# EAGLE design PinguinoHDK (EAGLE 6.2)
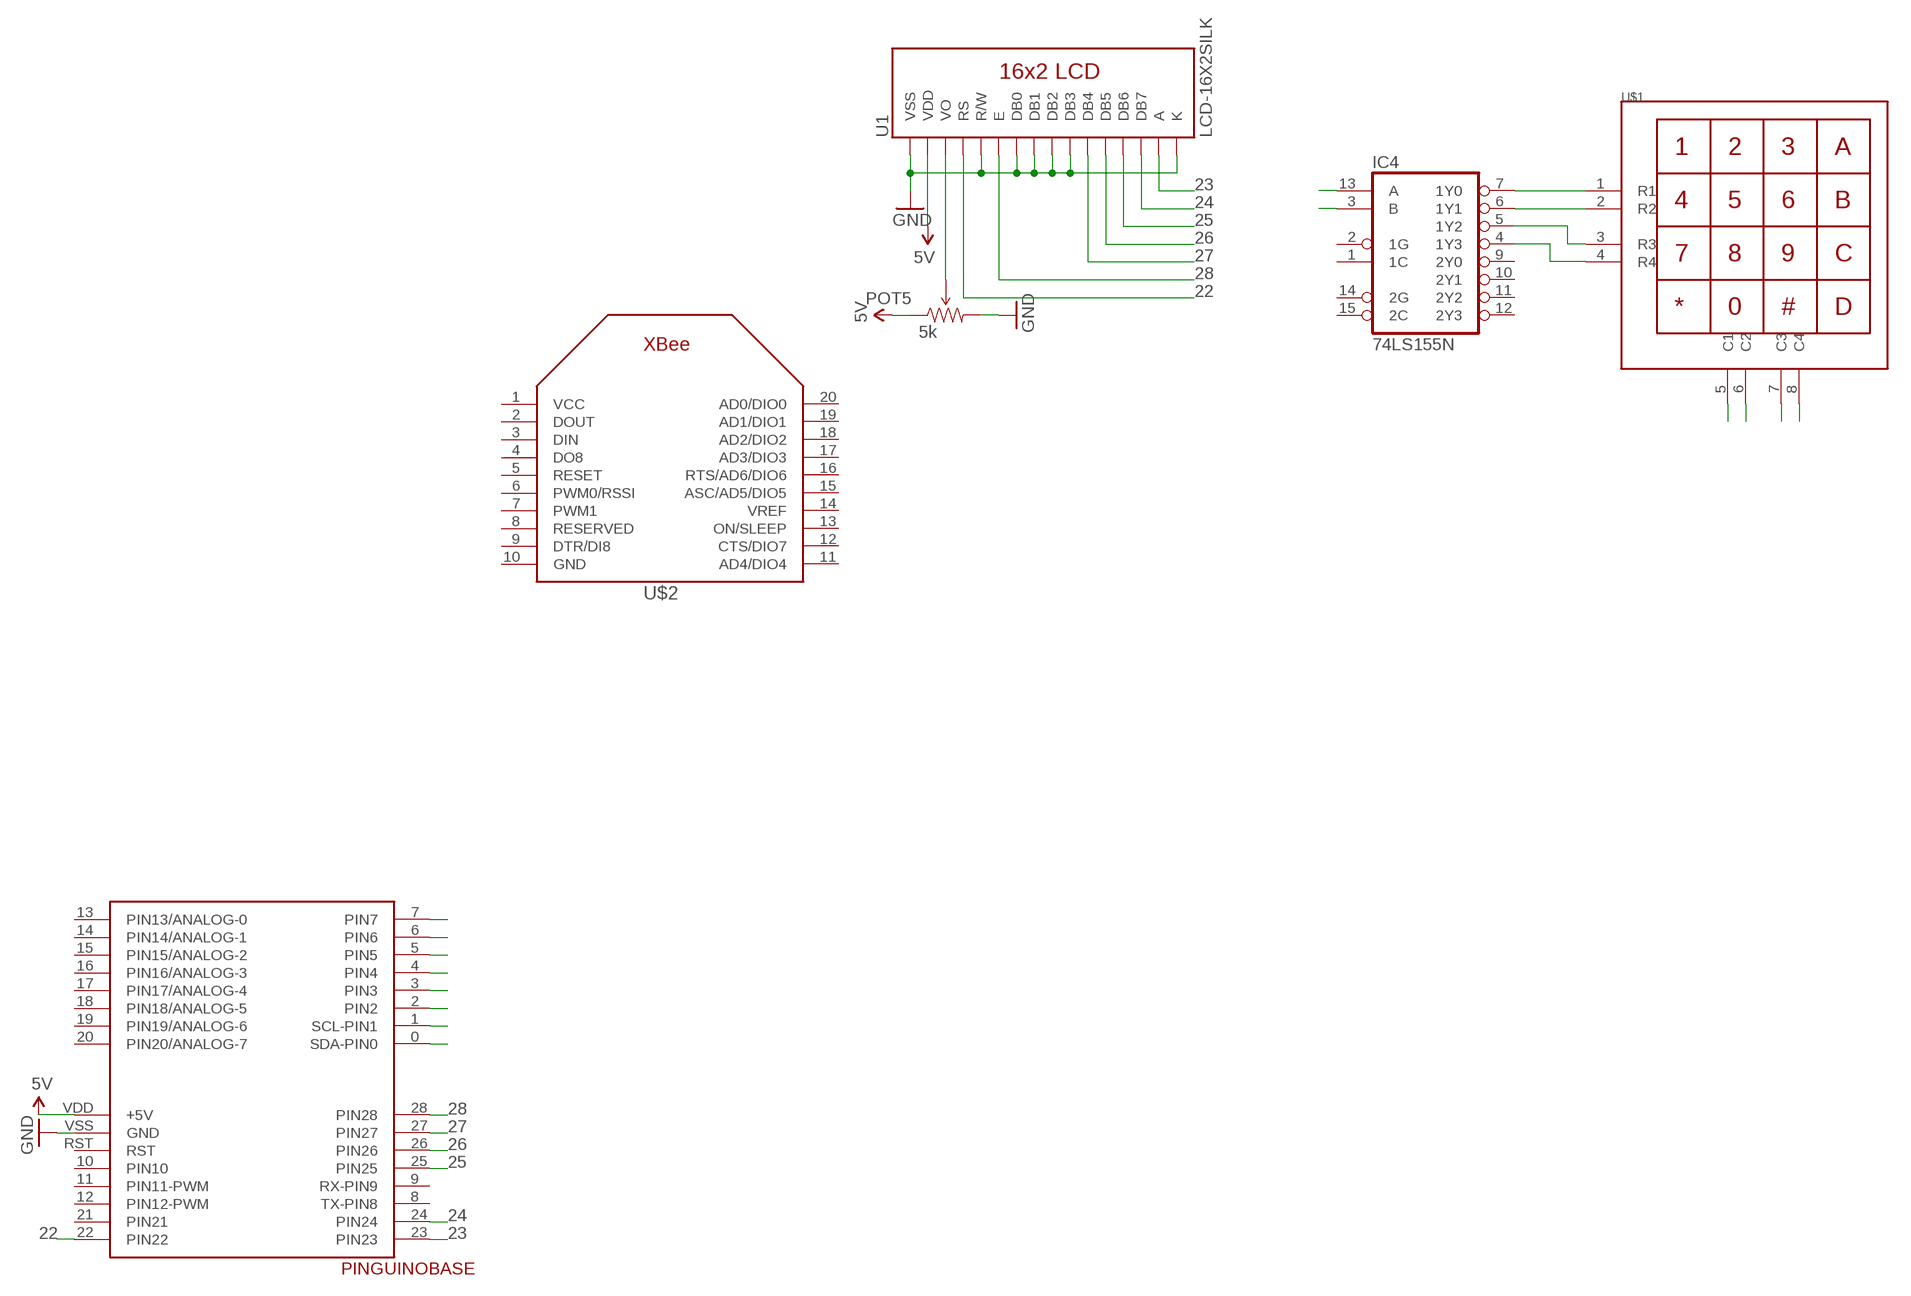
[diagram p0: schematic, sheet 1, part 1 of 2]
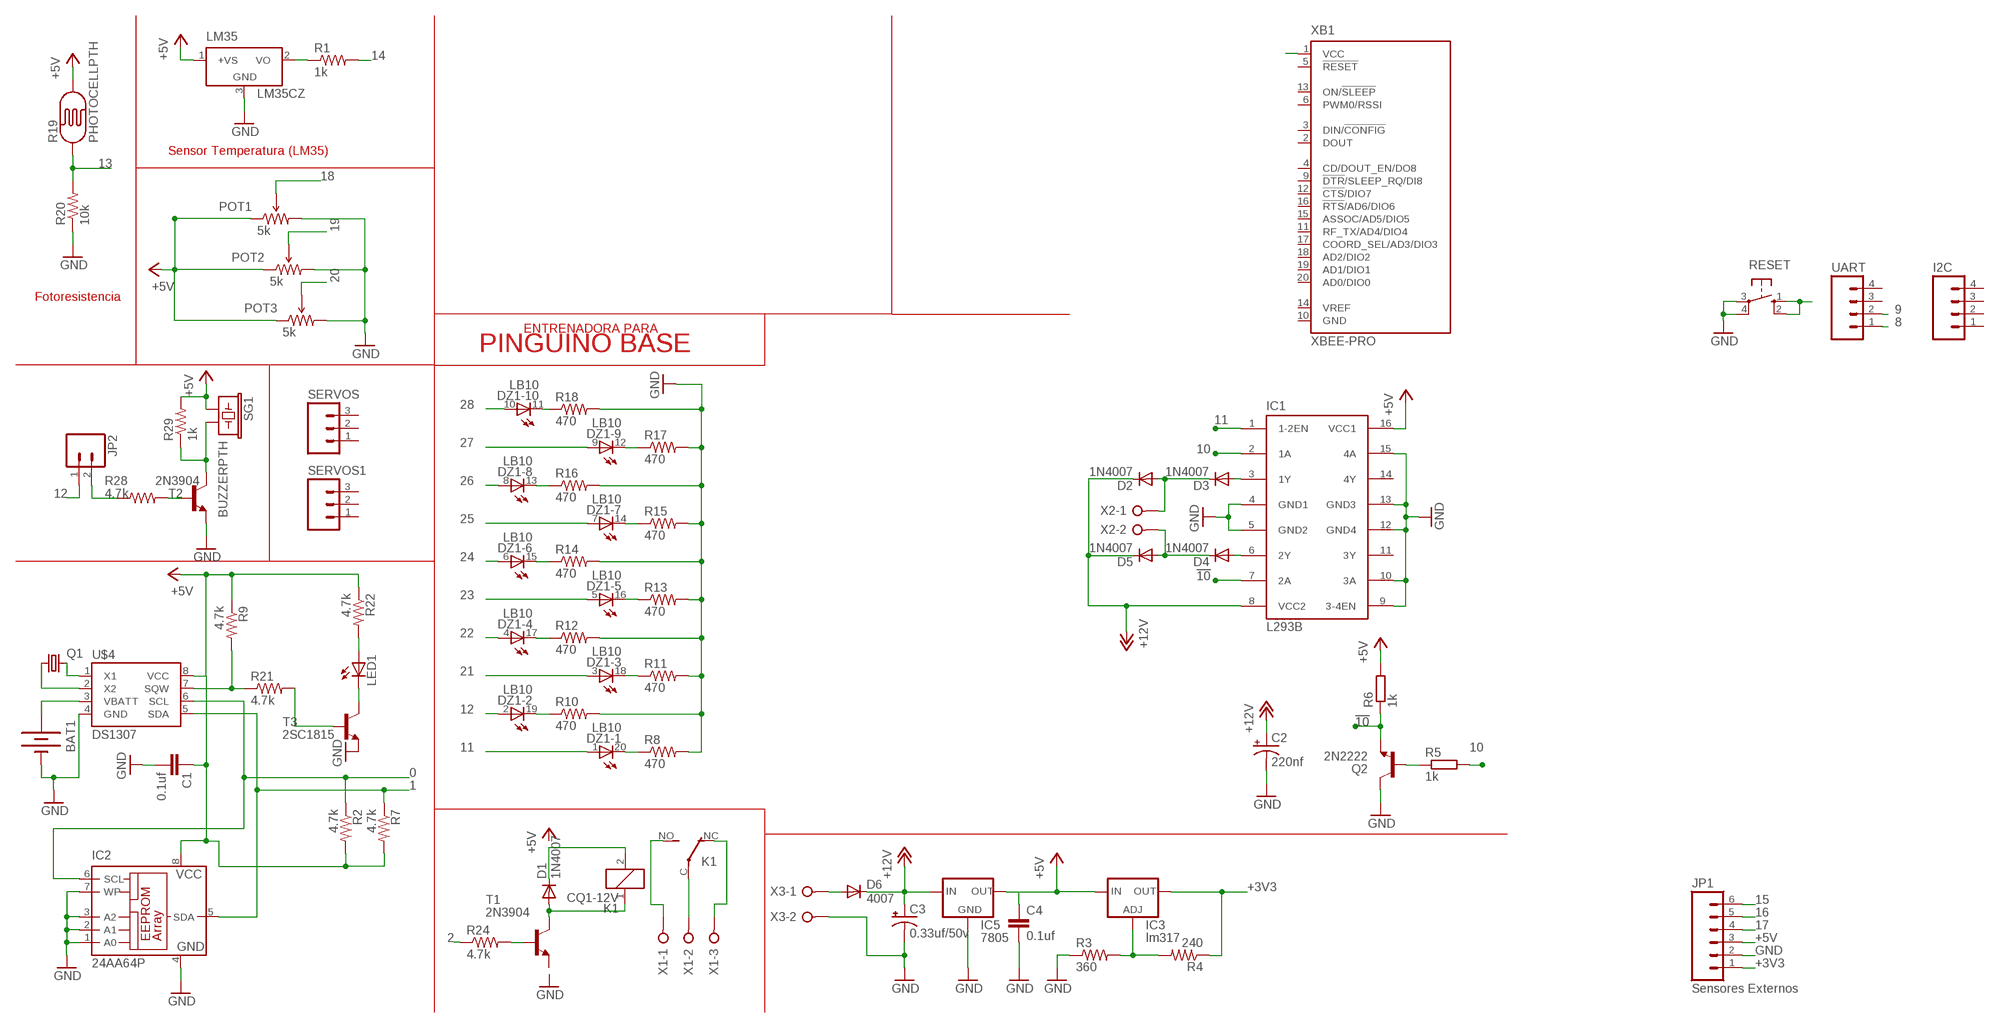
[diagram p1: schematic, sheet 1, part 2 of 2]

## Parts
BAT1  BATTERY20PTH  [BATTCOM_20MM_PTH]
C1  0.1uf  CAPPTH2  [CAP-PTH-SMALL2]
C2  220nf  CAP_POLPTH2  [CPOL-RADIAL-10UF-25V]
C3  0.33uf/50v  CAP_POLPTH2  [CPOL-RADIAL-10UF-25V]
C4  0.1uf  CAPPTH2  [CAP-PTH-SMALL2]
D1  1N4007  1N4004  [DO41-10]
D2  1N4007  1N4148DO35-7  [DO35-7]
D3  1N4007  1N4148DO35-7  [DO35-7]
D4  1N4007  1N4148DO35-7  [DO35-7]
D5  1N4007  1N4148DO35-7  [DO35-7]
D6  4007  1N4148DO35-7  [DO35-7]
DZ1  LB10  [LB10]
I2C  M04LONGPADS  [1X04_LONGPADS]
IC1  L293B  L293D  [DIL16]
IC2  24AA64P  [DIL8]
IC3  lm317  LM317TL  [317TL]
IC4  74LS155N  [DIL16]
IC5  7805  78XXL  [78XXL]
JP1  Sensores Externos  M06LONGPADS  [1X06_LONGPADS]
JP2  M02PTH3  [1X02_LONGPADS]
K1  CQ1-12V  [CQ1]
LED1  LED3MM  [LED3MM]
LM35  LM35CZ  [TO92]
PINGUINOBASE  PINGUINOBASEFACEDOWN  [FACEDOWN]
POT1  5k  TRIMPOTPTH  [TRIM_POT_PTH]
POT2  5k  TRIMPOTPTH  [TRIM_POT_PTH]
POT3  5k  TRIMPOTPTH  [TRIM_POT_PTH]
POT5  5k  TRIMPOTPTH  [TRIM_POT_PTH]
Q1  CRYSTALTC38H  [TC38H]
Q2  2N2222  TRANSISTOR_NPNTO92  [TO-92]
R1  1k  RESISTORKIT  [AXIAL-0.3-KIT]
R2  4.7k  RESISTORKIT  [AXIAL-0.3-KIT]
R3  360  RESISTORKIT  [AXIAL-0.3-KIT]
R4  240  RESISTORKIT  [AXIAL-0.3-KIT]
R5  1k  R-EU_0204/7  [0204/7]
R6  1k  R-EU_0204/7  [0204/7]
R7  4.7k  RESISTORKIT  [AXIAL-0.3-KIT]
R8  470  RESISTORKIT  [AXIAL-0.3-KIT]
R9  4.7k  RESISTORKIT  [AXIAL-0.3-KIT]
R10  470  RESISTORKIT  [AXIAL-0.3-KIT]
R11  470  RESISTORKIT  [AXIAL-0.3-KIT]
R12  470  RESISTORKIT  [AXIAL-0.3-KIT]
R13  470  RESISTORKIT  [AXIAL-0.3-KIT]
R14  470  RESISTORKIT  [AXIAL-0.3-KIT]
R15  470  RESISTORKIT  [AXIAL-0.3-KIT]
R16  470  RESISTORKIT  [AXIAL-0.3-KIT]
R17  470  RESISTORKIT  [AXIAL-0.3-KIT]
R18  470  RESISTORKIT  [AXIAL-0.3-KIT]
R19  PHOTOCELLPTH  [PHOTOCELL]
R20  10k  R-US_0204/5  [0204/5@1]
R21  4.7k  RESISTORKIT  [AXIAL-0.3-KIT]
R22  4.7k  RESISTORKIT  [AXIAL-0.3-KIT]
R24  4.7k  RESISTORKIT  [AXIAL-0.3-KIT]
R28  4.7k  RESISTORKIT  [AXIAL-0.3-KIT]
R29  1k  RESISTORKIT  [AXIAL-0.3-KIT]
RESET  10-XX  [B3F-10XX]
SERVOS  M03LONGPADS  [1X03_LONGPADS]
SERVOS1  M03LONGPADS  [1X03_LONGPADS]
SG1  BUZZERPTH  [BUZZER-12MM]
T1  2N3904  [TO92]
T2  2N3904  [TO92]
T3  2SC1815  [TO92-ECB]
U1  LCD-16X2SILK  [LCD-16X2]
U$1  KEYPAD4X4  [KEYPAD4X4]
U$2  XBEE  [XBEE]
U$4  DS1307  [PDIP8]
UART  M04LONGPADS  [1X04_LONGPADS]
X1  W237-3E  [W237-3E]
X2  W237-02P  [W237-132]
X3  W237-02P  [W237-132]
XB1  XBEE-PRO  [XBEE-PRO]

## Nets
0: IC2.6(SCL) PINGUINOBASE.0(SDA-PIN0) R2.P$1 U$4.6(SCL)
1: IC2.5(SDA) PINGUINOBASE.1(SCL-PIN1) R7.P$1 U$4.5(SDA)
2: IC4.3(B) PINGUINOBASE.2(PIN2) R24.P$1
3: IC4.13(A) PINGUINOBASE.3(PIN3)
4: PINGUINOBASE.4(PIN4) U$1.5(C1)
5: PINGUINOBASE.5(PIN5) U$1.6(C2)
5V: PINGUINOBASE.VDD(+5V) POT5.1(CCW) U1.2(VDD)
6: PINGUINOBASE.6(PIN6) U$1.7(C3)
7: PINGUINOBASE.7(PIN7) U$1.8(C4)
8: UART.1
9: UART.2
10: IC1.2(1A) R5.2
11: DZ1.1(-1:A) IC1.1(1-2EN)
12: DZ1.2(-2:A) JP2.1
13: R19.1 R20.2
14: R1.P$2
15: JP1.6
16: JP1.5
17: JP1.4
18: POT1.2(WIPER)
19: POT2.2(WIPER)
20: POT3.2(WIPER)
21: DZ1.3(-3:A)
22: DZ1.4(-4:A) PINGUINOBASE.22(PIN22) U1.4(RS)
23: DZ1.5(-5:A) PINGUINOBASE.23(PIN23) U1.15(A)
24: DZ1.6(-6:A) PINGUINOBASE.24(PIN24) U1.14(DB7)
25: DZ1.7(-7:A) PINGUINOBASE.25(PIN25) U1.13(DB6)
26: DZ1.8(-8:A) PINGUINOBASE.26(PIN26) U1.12(DB5)
27: DZ1.9(-9:A) PINGUINOBASE.27(PIN27) U1.11(DB4)
28: DZ1.10(-10:A) PINGUINOBASE.28(PIN28) U1.6(E)
!10: IC1.7(2A) Q2.1(E) R6.1
+3V3: IC3.2(OUT) JP1.1 R4.P$1 XB1.1(VCC)
+5V: C1.1 C4.1 IC1.16(VCC1) IC2.8(VCC) IC3.3(IN) IC5.OUT JP1.3 LM35.1(+VS) POT1.1(CCW) POT2.1(CCW) POT3.1(CCW) R2.P$2 R6.2 R7.P$2 R9.P$1 R19.2 R22.P$1 R29.P$2 SG1.+ U$4.8(VCC)
+12V: C2.1(+) C3.1(+) D2.C D5.C D6.C IC1.8(VCC2) IC5.IN
GND: BAT1.2(-) C1.2 C2.2(-) C3.2(-) C4.2 IC1.4(GND1) IC1.5(GND2) IC1.9(3-4EN) IC1.10(3A) IC1.12(GND4) IC1.13(GND3) IC1.15(4A) IC2.1(A0) IC2.2(A1) IC2.3(A2) IC2.4(GND) IC2.7(WP) IC5.GND JP1.2 LM35.3(GND) PINGUINOBASE.VSS(GND) POT1.3(CW) POT2.3(CW) POT3.3(CW) POT5.3(CW) Q2.3(C) R3.P$1 R8.P$2 R10.P$2 R11.P$2 R12.P$2 R13.P$2 R14.P$2 R15.P$2 R16.P$2 R17.P$2 R18.P$2 R20.1 RESET.3(P) RESET.4(P1) T2.3(E) T3.E U1.1(VSS) U1.5(R/W) U1.7(DB0) U1.8(DB1) U1.9(DB2) U1.10(DB3) U1.16(K) U$4.4(GND) X3.2
N$1: LM35.2(VO) R1.P$1
N$2: Q1.2 U$4.1(X1)
N$3: Q1.1 U$4.2(X2)
N$5: BAT1.1(+) U$4.3(VBATT)
N$6: POT5.2(WIPER) U1.3(VO)
N$7: IC3.1(ADJ) R3.P$2 R4.P$2
N$9: K1.C(2:P) X1.2
N$10: K1.NC(2:O) X1.3
N$11: K1.NO(2:S) X1.1
N$12: R24.P$2 T1.2(B)
N$14: R28.P$2 T2.2(B)
N$15: D1.A K1.1 T1.1(C)
N$16: R29.P$1 SG1.- T2.1(C)
N$18: JP2.2 R28.P$1
N$21: D3.A IC1.3(1Y)
N$22: D4.A IC1.6(2Y)
N$23: D4.C D5.A X2.2
N$24: D2.A D3.C X2.1
N$25: D6.A X3.1
N$27: DZ1.18(-3:C) R11.P$1
N$28: DZ1.16(-5:C) R13.P$1
N$29: DZ1.20(-1:C) R8.P$1
N$30: DZ1.19(-2:C) R10.P$1
N$31: DZ1.17(-4:C) R12.P$1
N$32: DZ1.15(-6:C) R14.P$1
N$33: DZ1.14(-7:C) R15.P$1
N$34: DZ1.13(-8:C) R16.P$1
N$35: DZ1.12(-9:C) R17.P$1
N$36: DZ1.11(-10:C) R18.P$1
N$37: LED1.A R22.P$2
N$38: R9.P$2 R21.P$1 U$4.7(SQW)
N$39: Q2.2(B) R5.1
N$40: R21.P$2 T3.B
N$41: LED1.K(C) T3.C
N$42: D1.C K1.2
N$45: IC4.4(1Y3) U$1.4(R4)
N$46: IC4.5(1Y2) U$1.3(R3)
N$47: IC4.6(1Y1) U$1.2(R2)
N$48: IC4.7(1Y0) U$1.1(R1)
RST: RESET.1(S) RESET.2(S1)
Unconnected: I2C.1 I2C.2 I2C.3 I2C.4 IC1.11(3Y) IC1.14(4Y) IC4.1(1C) IC4.2(1G) IC4.9(2Y0) IC4.10(2Y1) IC4.11(2Y2) IC4.12(2Y3) IC4.14(2G) IC4.15(2C) PINGUINOBASE.8(TX-PIN8) PINGUINOBASE.9(RX-PIN9) PINGUINOBASE.10(PIN10) PINGUINOBASE.11(PIN11-PWM) PINGUINOBASE.12(PIN12-PWM) PINGUINOBASE.13(PIN13/ANALOG-0) PINGUINOBASE.14(PIN14/ANALOG-1) PINGUINOBASE.15(PIN15/ANALOG-2) PINGUINOBASE.16(PIN16/ANALOG-3) PINGUINOBASE.17(PIN17/ANALOG-4) PINGUINOBASE.18(PIN18/ANALOG-5) PINGUINOBASE.19(PIN19/ANALOG-6) PINGUINOBASE.20(PIN20/ANALOG-7) PINGUINOBASE.21(PIN21) PINGUINOBASE.RST SERVOS1.1 SERVOS1.2 SERVOS1.3 SERVOS.1 SERVOS.2 SERVOS.3 T1.3(E) U$2.1(VCC) U$2.2(DOUT) U$2.3(DIN) U$2.4(DO8) U$2.5(RESET) U$2.6(PWM0/RSSI) U$2.7(PWM1) U$2.8(RESERVED) U$2.9(DTR/DI8) U$2.10(GND) U$2.11(AD4/DIO4) U$2.12(CTS/DIO7) U$2.13(ON/SLEEP) U$2.14(VREF) U$2.15(ASC/AD5/DIO5) U$2.16(RTS/AD6/DIO6) U$2.17(AD3/DIO3) U$2.18(AD2/DIO2) U$2.19(AD1/DIO1) U$2.20(AD0/DIO0) UART.3 UART.4 XB1.2(DOUT) XB1.3(DIN/!CONFIG) XB1.4(CD/DOUT_EN/DO8) XB1.5(!RESET) XB1.6(PWM0/RSSI) XB1.9(!DTR!/SLEEP_RQ/DI8) XB1.11(RF_TX/AD4/DIO4) XB1.12(!CTS!/DIO7) XB1.13(ON/!SLEEP) XB1.14(VREF) XB1.15(ASSOC/AD5/DIO5) XB1.16(!RTS!/AD6/DIO6) XB1.17(COORD_SEL/AD3/DIO3) XB1.18(AD2/DIO2) XB1.19(AD1/DIO1) XB1.20(AD0/DIO0)

## Notes on the sheet
- Sensor Temperatura (LM35)
- Fotoresistencia
- ENTRENADORA PARA
- PINGUINO BASE

## Power pins joined to a net without a drawn wire
GND: IC4.8(GND) XB1.10(GND)
VCC: IC4.16(VCC)

## Library data of the parts
BAT1 = SparkFun:BATTERY: Battery Holders Various common sizes : AA, AAA, 20mm coin cell and 12mm coin cell.
C1 C4 = SparkFun:CAP: Capacitor Standard 0603 ceramic capacitor, and 0.1" leaded capacitor.
C2 C3 = SparkFun:CAP_POL: Capacitor Polarized These are standard SMD and PTH capacitors. Normally 10uF, 47uF, and 100uF in electrolytic and tantalum varieties. Always verify the external diameter of the through hole cap, it varies with capacity, voltage, and manufacturer. The EIA devices should be standard.
D1 = adafruit:1N4004: DIODE General purpose 1N400x type rectifier (With bigger pads) http://www.ladyada.net/library/pcb/eaglelibrary.html
D2-D6 = diode:1N4148: DIODE high speed (Philips)
DZ1 = led:LB10: LED BLOCK 10-LED bar graph, DIL, Siemens
I2C UART = SparkFun:M04: Header 4 Standard 4-pin 0.1" header. Use with straight break away headers (SKU : PRT-00116), right angle break away headers (PRT-00553), swiss pins (PRT-00743), machine pins (PRT-00117), and female headers (PRT-00115). Molex polarized connector foot print use with SKU : PRT-08231 with associated crimp pins and housings. 1MM SMD Version SKU: PRT-10208
IC1 = st-microelectronics:L293D: PUSH-PULL 4 CHANNEL DRIVER; MPN: L293D; OC_FARNELL: 9589619; OC_NEWARK: 56P8249
IC2 = microchip:24*: Serial EEPROM I2C; MF: MICROCHIP; MPN: 24AA64-I/P; OC_FARNELL: 1331303; OC_NEWARK: 92C6909
IC3 = v-reg:LM317TL: VOLTAGE REGULATOR
IC4 = 74xx-us:74*155: Dual 2-line to 4-line data DECODER/DEMULTIPLEXER
IC5 = v-reg:78XXL: VOLTAGE REGULATOR
JP1 = SparkFun:M06: Header 6 Standard 6-pin 0.1" header. Use with straight break away headers (SKU : PRT-00116), right angle break away headers (PRT-00553), swiss pins (PRT-00743), machine pins (PRT-00117), and female headers (PRT-00115). Molex polarized connector foot print use with SKU : PRT-08094 with associated crimp pins and housings. NOTES ON THE VARIANTS LOCK and LOCK_LONGPADS... This footprint was designed to help hold the alignment of a through-hole component (i.e. 6-pin header) while soldering it into place. You may notice that each hole has been shifted either up or down by 0.005 of an inch from it's more standard position (which is a perfectly straight line). This slight alteration caused the pins (the squares in the middle) to touch the edges of the holes. Because they are alternating, it causes a "brace" to hold the component in place. 0.005 has proven to be the perfect amount of "off-center" position when using our standard breakaway headers. Although looks a little odd when you look at the bare footprint, once you have a header in there, the alteration is very hard to notice. Also, if you push a header all the way into place, it is covered up entirely on the bottom side. This idea of altering the position of holes to aid alignment will be further integrated into the Sparkfun Library for other footprints. It can help hold any component with 3 or more connection pins.
JP2 = SparkFun:M02: Header 2 Standard 2-pin 0.1" header. Use with straight break away headers (SKU : PRT-00116), right angle break away headers (PRT-00553), swiss pins (PRT-00743), machine pins (PRT-00117), and female headers (PRT-00115). Molex polarized connector foot print use with SKU : PRT-08233 with associated crimp pins and housings.
K1 = relay:CQ1-12V: AUTOMOTIVE QUIET RELAY NAiS Source: http://www.mew-europe.com/.. en_ds_61208_0000.pdf; OC_FARNELL: unknown; OC_NEWARK: unknown
LED1 = adafruit:LED: LED OSRAM: - CHIPLED LG R971, LG N971, LY N971, LG Q971, LY Q971, LO R971, LY R971 LH N974, LH R974 LS Q976, LO Q976, LY Q976 LO Q996 - Hyper CHIPLED LW Q18S LB Q993, LB Q99A, LB R99A - SideLED LS A670, LO A670, LY A670, LG A670, LP A670 LB A673, LV A673, LT A673, LW A673 LH A674 LY A675 LS A676, LA A676, LO A676, LY A676, LW A676 LS A679, LY A679, LG A679 - Hyper Micro SIDELED® LS Y876, LA Y876, LO Y876, LY Y876 LT Y87S - SmartLED LW L88C, LW L88S LB L89C, LB L89S, LG L890 LS L89K, LO L89K, LY L89K LS L896, LA L896, LO L896, LY L896 - TOPLED LS T670, LO T670, LY T670, LG T670, LP T670 LSG T670, LSP T670, LSY T670, LOP T670, LYG T670 LG T671, LOG T671, LSG T671 LB T673, LV T673, LT T673, LW T673 LH T674 LS T676, LA T676, LO T676, LY T676, LB T676, LH T676, LSB T676, LW T676 LB T67C, LV T67C, LT T67C, LS T67K, LO T67K, LY T67K, LW E67C LS E67B, LA E67B, LO E67B, LY E67B, LB E67C, LV E67C, LT E67C LW T67C LS T679, LY T679, LG T679 LS T770, LO T770, LY T770, LG T770, LP T770 LB T773, LV T773, LT T773, LW T773 LH T774 LS E675, LA E675, LY E675, LS T675 LS T776, LA T776, LO T776, LY T776, LB T776 LHGB T686 LT T68C, LB T68C - Hyper Mini TOPLED® LB M676 - Mini TOPLED Santana® LG M470 LS M47K, LO M47K, LY M47K Source: http://www.osram.convergy.de/
LM35 = lm35:LM35: Single-Supply Centigrade Temperature Sensor Vout = (10mV/°C x Temp °C) +5mmmV Source: http://www.national.com/ds/LM/LM35.pdf
PINGUINOBASE = PinguinoBase:PINGUINOBASE: Pinguino Base: Placa de desarrollo para Pinguino pic
POT1-POT3 POT5 = SparkFun:TRIMPOT
Q1 = crystal:CRYSTAL: CRYSTAL; OC_FARNELL: unknown; OC_NEWARK: unknown
Q2 = SparkFun:TRANSISTOR_NPN: Transistor NPN BJT configuration in SOT23 package. MMBT2222 is the common NPN we use. Double check BCE configuration again layout.
R1-R4 R7-R18 R21 R22 R24 R28 R29 = SparkFun:RESISTOR: Resistor Basic schematic elements and footprints for 0603, 1206, and PTH resistors.
R5 R6 = rcl:R-EU_: RESISTOR, European symbol
R19 = SparkFun:PHOTOCELL: Photocell Also known as a CdS photoresistor. This is a low cost way to detect light levels. Resistance decreases with more incoming light. SparkFun SKU: SEN-09088
R20 = rcl:R-US_: RESISTOR, American symbol
RESET = switch-omron:10-XX: OMRON SWITCH; MPN: B3F-1000; OC_FARNELL: 176432; OC_NEWARK: 36M3542
SERVOS SERVOS1 = SparkFun:M03: Header 3 Standard 3-pin 0.1" header. Use with straight break away headers (SKU : PRT-00116), right angle break away headers (PRT-00553), swiss pins (PRT-00743), machine pins (PRT-00117), and female headers (PRT-00115). Molex polarized connector foot print use with SKU : PRT-08232 with associated crimp pins and housings.
SG1 = SparkFun:BUZZER: Buzzer 12mm Spark Fun Electronics SKU : Comp-Buzzer
T1 T2 = transistor:2N3904: NPN TRANSISTOR
T3 = transistor:2SC1815: NPN EPITAXIAL TRANSISTOR Source: TOSHIBA .. 2SC1815 1.pdf
U1 = SparkFun:LCD-16X2
U$1 = keypad4x4_ece:KEYPAD4X4
U$2 = adafruit:XBEE
U$4 = aasanchez:DS1307
X1 = con-wago-508:W237-3E: WAGO SREW CLAMP; OC_FARNELL: unknown; OC_NEWARK: unknown
X2 X3 = con-wago-508:W237-02P: WAGO SREW CLAMP; OC_FARNELL: unknown; OC_NEWARK: unknown
XB1 = maxstream:XBEE: XBee (TM) /XBee-PRO(TM) OEM RF Modules Source: MaxStream, Inc. xbee_productmanual.pdf; MPN: XBP24-AWI-001; OC_FARNELL: 1337916; OC_NEWARK: 42M2667

## Board
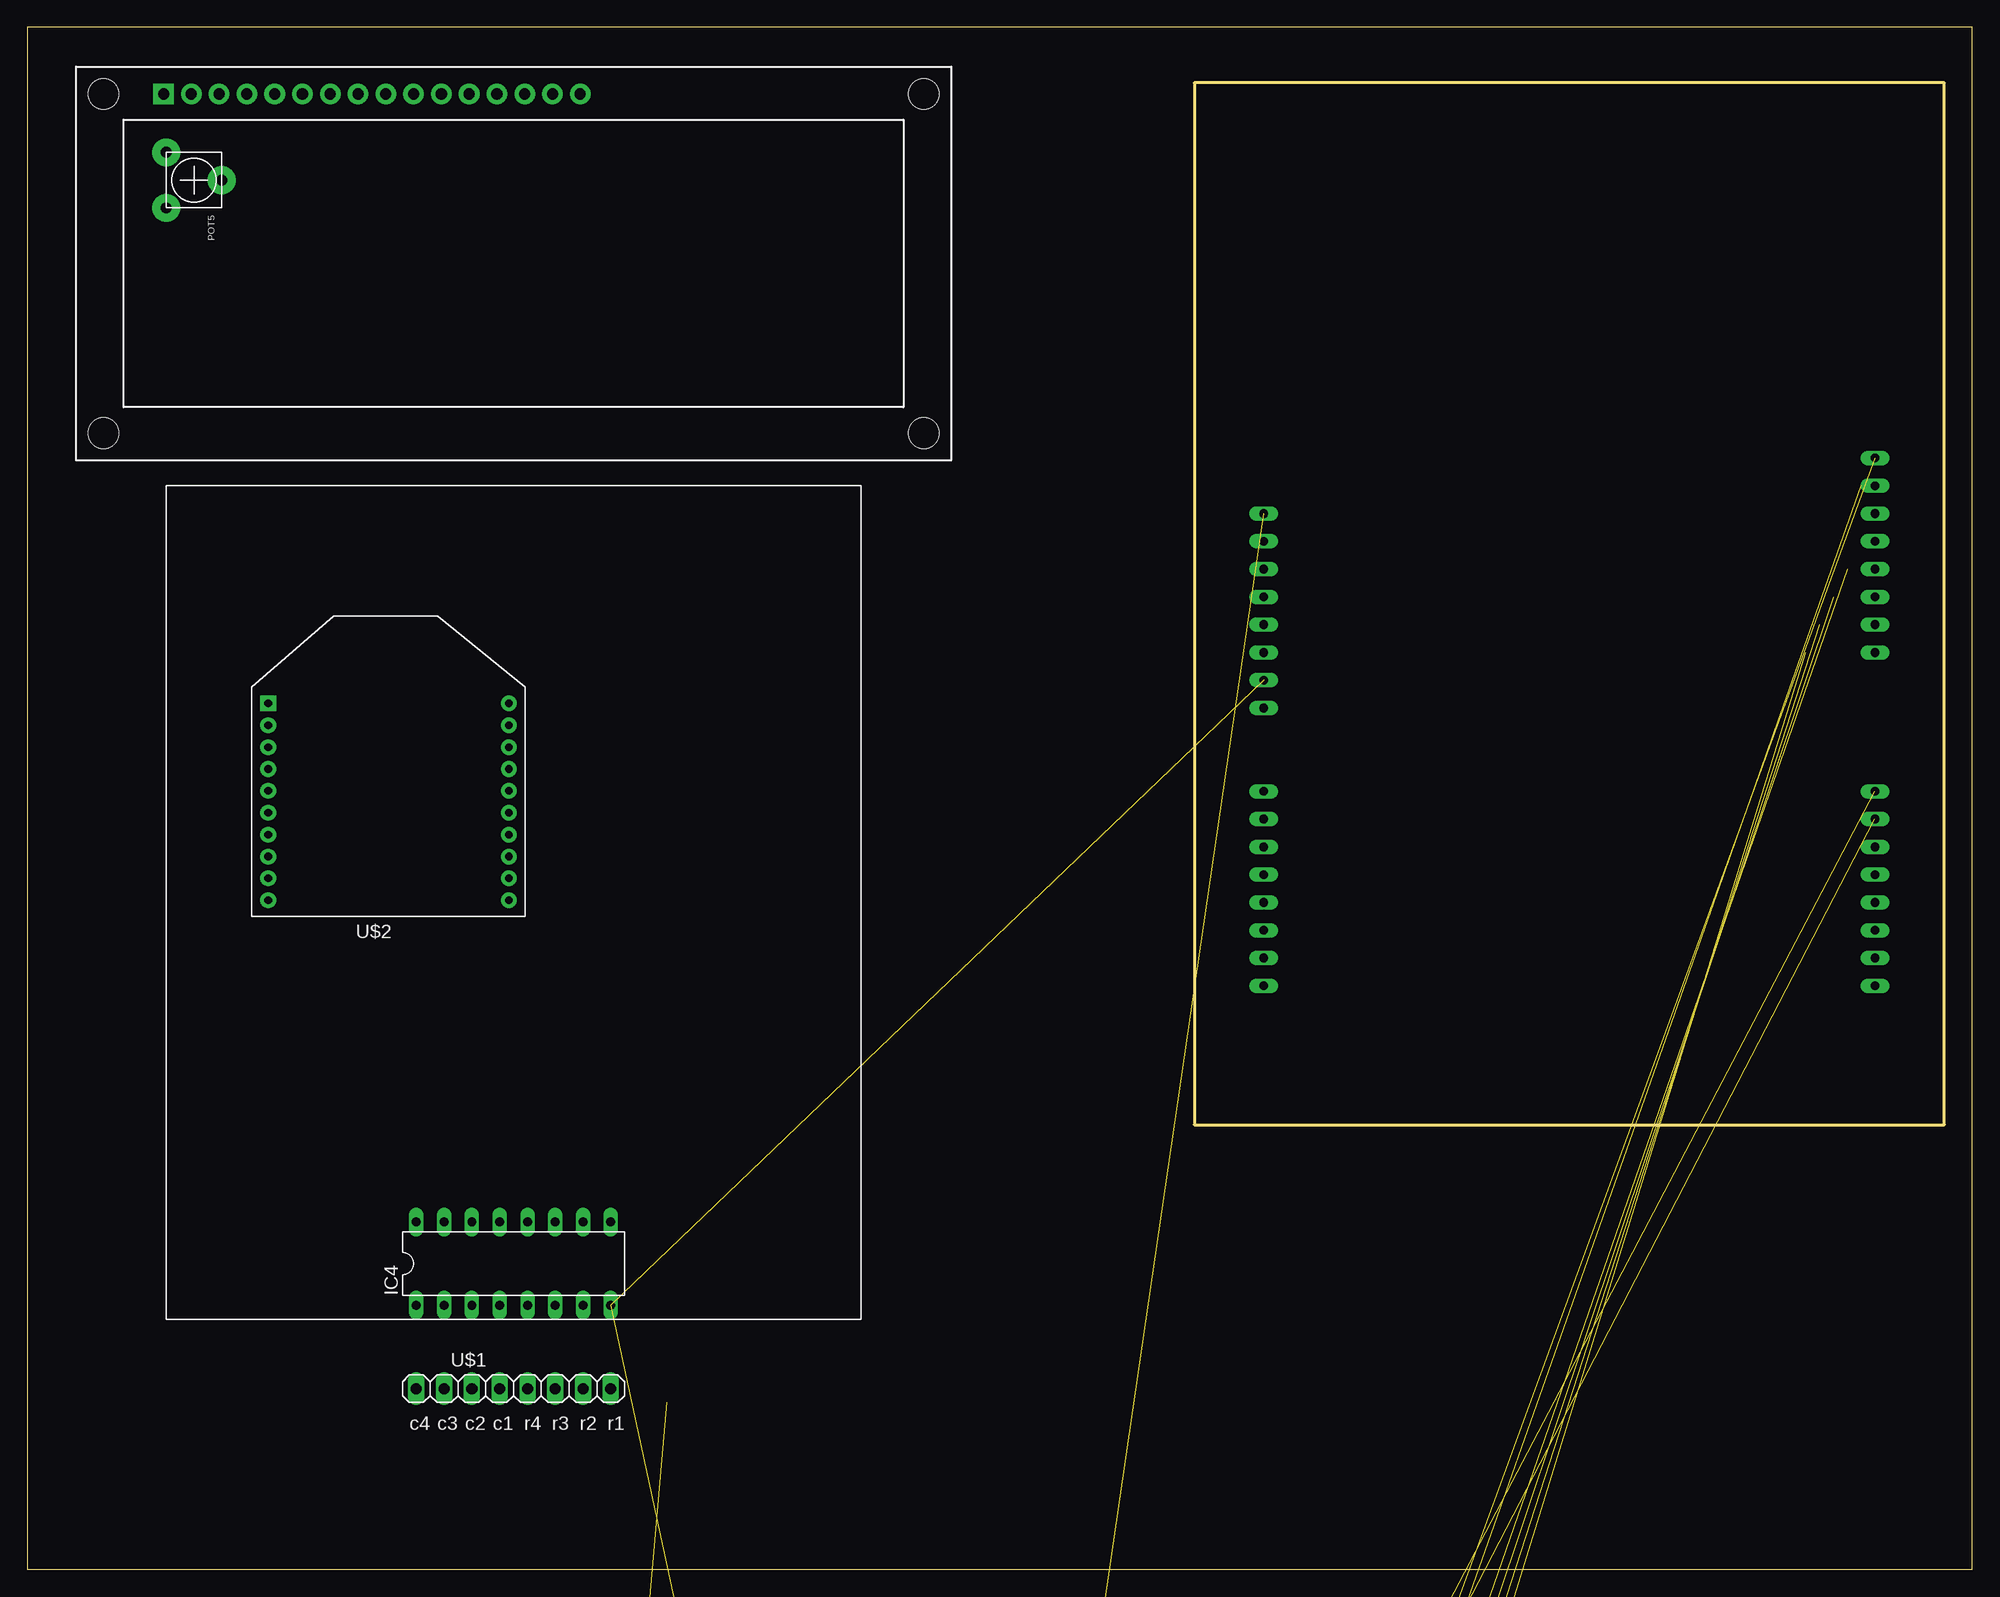
[diagram p2: board, top side]
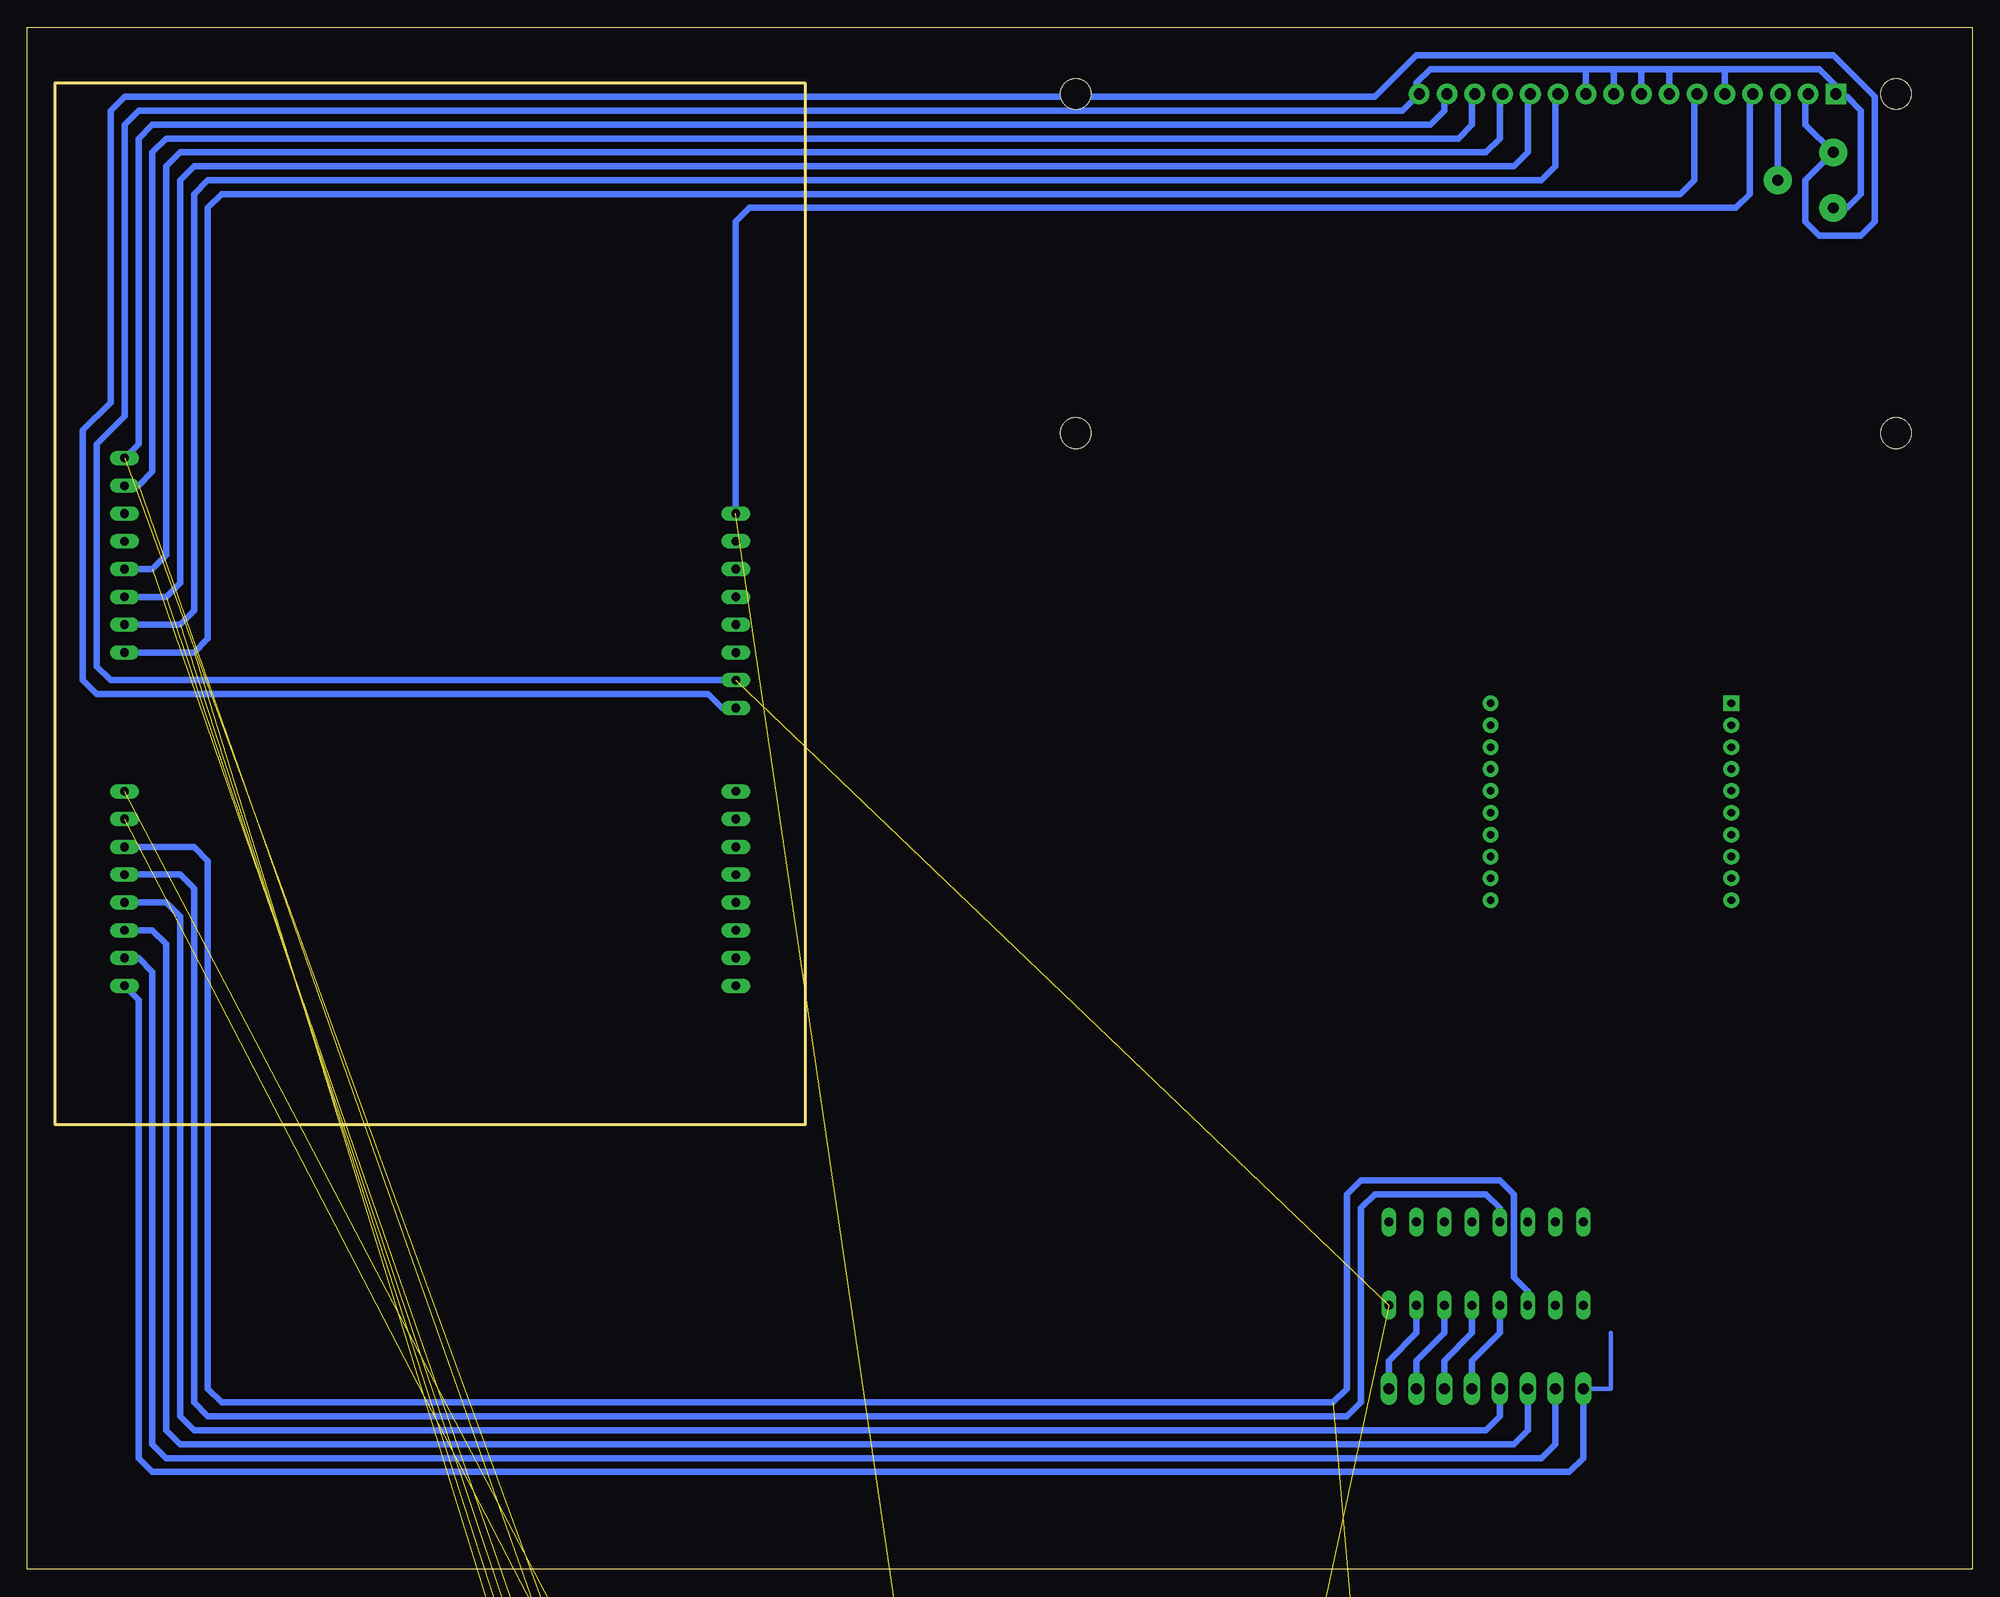
[diagram p3: board, bottom side, seen from below]

Size 177.8 x 140.97 mm. Coordinates in mm from the lower left corner, seen from the top.
Outline: 0,0 177.8,0 177.8,140.97 0,140.97 0,0
Copper layers (1*16): Top 0.035mm / dielectric 1.5mm / Bottom 0.035mm
Design rules: minimum track width 10mil, minimum drill 24mil, track to track 8mil, track to pad 8mil, pad to pad 8mil, via to via 8mil, smd to smd 8mil, copper to edge 40mil, drill to drill 8mil, minimum pad ring 10mil, minimum via ring 8mil, stop-mask expansion 4mil, vias tented up to drill 0mil, thermal gap 10mil

### Footprints (pad centres in the part's own frame; a part is rotated, then mirrored left to right if it is on the bottom)
BATTCOM_20MM_PTH = drill 1.3: 1 20,0; 2 0,0
CAP-PTH-SMALL2 = drill 0.7 pad 2.184: 1 0,0; 2 2.54,0
CPOL-RADIAL-10UF-25V = drill 0.7 pad 2.184 square: 1 1.27,0 | drill 0.7 pad 2.184: 2 -1.27,0
DO41-10 = drill 1.118 pad 1.93: A 5.08,0; C -5.08,0
DO35-7 = drill 0.813 pad 1.778 long: A 3.81,0; C -3.81,0
LB10 = drill 0.813 long: 1 -11.43,-3.81; 2 -8.89,-3.81; 3 -6.35,-3.81; 4 -3.81,-3.81; 5 -1.27,-3.81; 6 1.27,-3.81; 7 3.81,-3.81; 8 6.35,-3.81; 9 8.89,-3.81; 10 11.43,-3.81; 11 11.43,3.81; 12 8.89,3.81; 13 6.35,3.81; 14 3.81,3.81; 15 1.27,3.81; 16 -1.27,3.81; 17 -3.81,3.81; 18 -6.35,3.81; 19 -8.89,3.81; 20 -11.43,3.81
1X04_LONGPADS = drill 1.118 pad 1.88 long: 1 0,0; 2 2.54,0; 3 5.08,0; 4 7.62,0
DIL16 = drill 0.813 long: 1 -8.89,-3.81; 2 -6.35,-3.81; 3 -3.81,-3.81; 4 -1.27,-3.81; 5 1.27,-3.81; 6 3.81,-3.81; 7 6.35,-3.81; 8 8.89,-3.81; 9 8.89,3.81; 10 6.35,3.81; 11 3.81,3.81; 12 1.27,3.81; 13 -1.27,3.81; 14 -3.81,3.81; 15 -6.35,3.81; 16 -8.89,3.81
DIL8 = drill 0.813 long: 1 -3.81,-3.81; 2 -1.27,-3.81; 3 1.27,-3.81; 4 3.81,-3.81; 5 3.81,3.81; 6 1.27,3.81; 7 -1.27,3.81; 8 -3.81,3.81
317TL = drill 1.016 long: 1 -2.54,-3.81; 2 0,-3.81; 3 2.54,-3.81 | hole 3.302: 0,11.176
78XXL = drill 1.016 long: GND 0,-3.81; IN -2.54,-3.81; OUT 2.54,-3.81 | hole 3.302: 0,11.176
1X06_LONGPADS = drill 1.118 pad 1.88 long: 1 0,0; 2 2.54,0; 3 5.08,0; 4 7.62,0; 5 10.16,0; 6 12.7,0
1X02_LONGPADS = drill 1.118 pad 1.88 long: 1 0,0; 2 2.54,0
CQ1 = drill 1.5: 1 4.5,-5; 2 4.5,5; C 7,0; NC -5.7,-5; NO -5.7,5
LED3MM = drill 0.813 pad 1.93 octagon: A -1.27,0; K 1.27,0
TO92 = drill 0.813 octagon: 1 -1.27,0; 2 0,1.905; 3 1.27,0
FACEDOWN = drill 0.8 long: 0 62.23,30.48; 1 62.23,27.94; 2 62.23,25.4; 3 62.23,22.86; 4 62.23,20.32; 5 62.23,17.78; 6 62.23,15.24; 7 62.23,12.7; 8 62.23,55.88; 9 62.23,53.34; 10 6.35,45.72; 11 6.35,48.26; 12 6.35,50.8; 13 6.35,12.7; 14 6.35,15.24; 15 6.35,17.78; 16 6.35,20.32; 17 6.35,22.86; 18 6.35,25.4; 19 6.35,27.94; 20 6.35,30.48; 21 6.35,53.34; 22 6.35,55.88; 23 62.23,60.96; 24 62.23,58.42; 25 62.23,50.8; 26 62.23,48.26; 27 62.23,45.72; 28 62.23,43.18; RST 6.35,43.18; VDD 6.35,38.1; VSS 6.35,40.64
TRIM_POT_PTH = drill 1 pad 2.54: 1 -2.54,-2.54; 2 0,2.54; 3 2.54,-2.54
TC38H = drill 0.813: 1 -1.27,0; 2 1.27,0
TO-92 = drill 0.813 pad 1.88 offset: 1 -1.27,0; 2 0,1.905; 3 1.27,0
AXIAL-0.3-KIT = drill 1.016 pad 2.184 long: P$1 -3.81,0; P$2 3.81,0
0204/7 = drill 0.813 pad 2.184 octagon: 1 -3.81,0; 2 3.81,0
PHOTOCELL = drill 0.8 pad 1.676: 1 -2,0; 2 2,0
0204/5@1 = drill 0.813 pad 1.93 octagon: 1 -2.54,0; 2 2.54,0
B3F-10XX = drill 1.016 long: 1 -3.251,2.261; 2 3.251,2.261; 3 -3.251,-2.261; 4 3.251,-2.261
1X03_LONGPADS = drill 1.118 pad 1.88 long: 1 0,0; 2 2.54,0; 3 5.08,0
BUZZER-12MM = drill 0.9 pad 1.778: + 3.25,0; - -3.25,0
TO92' = drill 0.813 octagon: 1 1.27,0; 2 0,1.905; 3 -1.27,0
TO92-ECB = drill 0.813 long: B 2.54,0; C 0,0; E -2.54,0
LCD-16X2 = drill 1.016 pad 1.88 square: 1 -32,15.5 | drill 1.016 pad 1.88: 2 -29.46,15.5; 3 -26.92,15.5; 4 -24.38,15.5; 5 -21.84,15.5; 6 -19.3,15.5; 7 -16.76,15.5; 8 -14.22,15.5; 9 -11.68,15.5; 10 -9.14,15.5; 11 -6.6,15.5; 12 -4.06,15.5; 13 -1.52,15.5; 14 1.02,15.5; 15 3.56,15.5; 16 6.1,15.5 | hole 2.8: -37.5,15.5; -37.5,-15.5; 37.5,15.5; 37.5,-15.5
KEYPAD4X4 = drill 1.016 long: 1 0,0; 2 2.54,0; 3 5.08,0; 4 7.62,0; 5 10.16,0; 6 12.7,0; 7 15.24,0; 8 17.78,0
XBEE = drill 0.7 pad 1.422 square: 1 -11,5.5 | drill 0.7 pad 1.422: 2 -11,3.5; 3 -11,1.5; 4 -11,-0.5; 5 -11,-2.5; 6 -11,-4.5; 7 -11,-6.5; 8 -11,-8.5; 9 -11,-10.5; 10 -11,-12.5; 11 11,-12.5; 12 11,-10.5; 13 11,-8.5; 14 11,-6.5; 15 11,-4.5; 16 11,-2.5; 17 11,-0.5; 18 11,1.5; 19 11,3.5; 20 11,5.5
PDIP8 = drill 0.813 long: 1 0,0; 2 2.54,0; 3 5.08,0; 4 7.62,0; 5 7.62,7.62; 6 5.08,7.62; 7 2.54,7.62; 8 0,7.62
W237-3E = drill 1.194 long: 1 -5.08,-0.635; 2 0,-0.635; 3 5.08,-0.635
W237-132 = drill 1.194 long: 1 -2.54,-0.635; 2 2.54,-0.635
XBEE-PRO = drill 0.8 pad 1.27: 1 -11,9; 2 -11,7; 3 -11,5; 4 -11,3; 5 -11,1; 6 -11,-1; 7 -11,-3; 8 -11,-5; 9 -11,-7; 10 -11,-9; 11 11,-9; 12 11,-7; 13 11,-5; 14 11,-3; 15 11,-1; 16 11,1; 17 11,3; 18 11,5; 19 11,7; 20 11,9

### Placement (x,y rotation side)
BAT1  7.62,-137.16 0 top  (outside the outline)
C1  85.09,-173.99 0 top  (outside the outline)
C2  90.17,-163.83 0 top  (outside the outline)
C3  82.55,-163.83 0 top  (outside the outline)
C4  91.44,-173.99 0 top  (outside the outline)
D1  99.06,-165.1 0 top  (outside the outline)
D2  25.4,-173.99 0 top  (outside the outline)
D3  38.1,-173.99 0 top  (outside the outline)
D4  50.8,-173.99 0 top  (outside the outline)
D5  63.5,-173.99 0 top  (outside the outline)
D6  76.2,-173.99 0 top  (outside the outline)
DZ1  82.55,-134.62 0 top  (outside the outline)
I2C  107.95,-166.37 0 top  (outside the outline)
IC1  52.07,-154.94 0 top  (outside the outline)
IC2  60.96,-135.89 0 top  (outside the outline)
IC3  35.56,-142.24 0 top  (outside the outline)
IC4  44.45,27.94 0 top
IC5  46.99,-142.24 0 top  (outside the outline)
JP1  2.54,-166.37 0 top  (outside the outline)
JP2  38.1,-180.34 0 top  (outside the outline)
K1  104.14,-133.35 0 top  (outside the outline)
LED1  29.21,-180.34 0 top  (outside the outline)
LM35  106.68,-175.26 0 top  (outside the outline)
PINGUINOBASE  106.68,40.64 0 top
POT1  21.59,-165.1 0 top  (outside the outline)
POT2  31.75,-165.1 0 top  (outside the outline)
POT3  41.91,-165.1 0 top  (outside the outline)
POT5  15.24,127 270 top
Q1  78.74,-158.75 0 top  (outside the outline)
Q2  73.66,-166.37 0 top  (outside the outline)
R1  68.58,-180.34 0 top  (outside the outline)
R2  81.28,-180.34 0 top  (outside the outline)
R3  93.98,-180.34 0 top  (outside the outline)
R4  106.68,-180.34 0 top  (outside the outline)
R5  46.99,-180.34 0 top  (outside the outline)
R6  57.15,-180.34 0 top  (outside the outline)
R7  119.38,-180.34 0 top  (outside the outline)
R8  6.35,-185.42 0 top  (outside the outline)
R9  19.05,-185.42 0 top  (outside the outline)
R10  31.75,-185.42 0 top  (outside the outline)
R11  44.45,-185.42 0 top  (outside the outline)
R12  57.15,-185.42 0 top  (outside the outline)
R13  69.85,-185.42 0 top  (outside the outline)
R14  82.55,-185.42 0 top  (outside the outline)
R15  95.25,-185.42 0 top  (outside the outline)
R16  107.95,-185.42 0 top  (outside the outline)
R17  120.65,-185.42 0 top  (outside the outline)
R18  6.35,-194.31 0 top  (outside the outline)
R19  60.96,-165.1 0 top  (outside the outline)
R20  99.06,-173.99 0 top  (outside the outline)
R21  19.05,-189.23 0 top  (outside the outline)
R22  31.75,-189.23 0 top  (outside the outline)
R24  44.45,-189.23 0 top  (outside the outline)
R28  57.15,-189.23 0 top  (outside the outline)
R29  69.85,-189.23 0 top  (outside the outline)
RESET  109.22,-153.67 0 top  (outside the outline)
SERVOS  12.7,-175.26 0 top  (outside the outline)
SERVOS1  2.54,-175.26 0 top  (outside the outline)
SG1  119.38,-132.08 0 top  (outside the outline)
T1  2N3904  [TO92']  3.81,-180.34 0 top  (outside the outline)
T2  2N3904  [TO92']  16.51,-180.34 0 top  (outside the outline)
T3  118.11,-153.67 0 top  (outside the outline)
U1  44.45,119.38 0 top
U$1  53.34,16.51 180 top
U$2  33.02,73.66 0 top
U$4  66.04,-158.75 0 top  (outside the outline)
UART  119.38,-166.37 0 top  (outside the outline)
X1  8.89,-153.67 0 top  (outside the outline)
X2  86.36,-153.67 0 top  (outside the outline)
X3  97.79,-153.67 0 top  (outside the outline)
XB1  93.98,-104.14 0 top  (outside the outline)

### Tracks (layer width: path | path; a pad name or v marks a point on that pad's centre or on a via)
0  (3 unrouted)
1  (3 unrouted)
2  (1 unrouted)
  Bottom 0.61: PINGUINOBASE.2 162.56,66.04 161.29,64.77 161.29,16.51 160.02,15.24 58.42,15.24 57.15,16.51 57.15,34.29 55.88,35.56 43.18,35.56 41.91,34.29 41.91,26.67 40.64,25.4 IC4.3
3
  Bottom 0.61: IC4.13 43.18,33.02 44.45,34.29 54.61,34.29 55.88,33.02 55.88,15.24 57.15,13.97 161.29,13.97 162.56,15.24 162.56,62.23 163.83,63.5 PINGUINOBASE.3
4
  Bottom 0.61: U$1.5 43.18,13.97 44.45,12.7 162.56,12.7 163.83,13.97 163.83,59.69 165.1,60.96 PINGUINOBASE.4
5
  Bottom 0.61: U$1.6 40.64,12.7 41.91,11.43 163.83,11.43 165.1,12.7 165.1,57.15 166.37,58.42 PINGUINOBASE.5
5V
  Bottom 0.61: U1.2 15.24,134.63 15.24,132.08 POT5.1 15.24,127 15.24,123.19 13.97,121.92 10.16,121.92 8.89,123.19 8.89,134.62 12.7,138.43 50.8,138.43 54.61,134.62 168.91,134.62 170.18,133.35 170.18,106.68 172.72,104.14 172.72,81.28 171.45,80.01 115.57,80.01 114.3,78.74 PINGUINOBASE.VDD
6
  Bottom 0.61: U$1.7 38.1,11.43 39.37,10.16 165.1,10.16 166.37,11.43 166.37,54.61 167.64,55.88 PINGUINOBASE.6
7
  Bottom 0.406: U$1.8 33.02,16.51 33.02,21.59
  Bottom 0.61: PINGUINOBASE.7 167.64,52.07 167.64,10.16 166.37,8.89 36.83,8.89 35.56,10.16 U$1.8
10  (1 unrouted)
11  (1 unrouted)
12  (1 unrouted)
13  (1 unrouted)
22  (1 unrouted)
  Bottom 0.61: PINGUINOBASE.22 113.03,123.19 111.76,124.46 21.59,124.46 20.32,125.73 20.32,134.63 U1.4
23  (1 unrouted)
  Bottom 0.61: U1.15 48.26,134.63 48.26,133.35 49.53,132.08 166.37,132.08 167.64,130.81 167.64,102.87 PINGUINOBASE.23
24  (1 unrouted)
  Bottom 0.61: PINGUINOBASE.24 167.64,99.06 166.37,100.33 166.37,129.54 165.1,130.81 46.99,130.81 45.72,132.08 45.72,134.63 U1.14
25  (1 unrouted)
  Bottom 0.61: PINGUINOBASE.25 166.37,91.44 165.1,92.71 165.1,128.27 163.83,129.54 44.45,129.54 43.18,130.81 43.18,134.63 U1.13
26  (1 unrouted)
  Bottom 0.61: PINGUINOBASE.26 165.1,88.9 163.83,90.17 163.83,127 162.56,128.27 41.91,128.27 40.64,129.54 40.64,134.63 U1.12
27  (1 unrouted)
  Bottom 0.61: PINGUINOBASE.27 163.83,86.36 162.56,87.63 162.56,125.73 161.29,127 39.37,127 38.1,128.27 38.1,134.63 U1.11
28  (1 unrouted)
  Bottom 0.61: PINGUINOBASE.28 162.56,83.82 161.29,85.09 161.29,124.46 160.02,125.73 26.67,125.73 25.4,127 25.4,134.63 U1.6
!10  (2 unrouted)
+3V3  (3 unrouted)
+5V  (19 unrouted)
+12V  (6 unrouted)
GND  (44 unrouted)
  Bottom 0.61: 22.86,137.16 13.97,137.16 12.45,135.64 U1.1 12.19,134.62 11.43,134.62 10.16,133.35 10.16,125.73 11.43,124.46 POT5.3 | 22.86,137.16 27.94,137.16 | 27.94,137.16 30.48,137.16 | 30.48,137.16 33.02,137.16 | 33.02,137.16 35.56,137.16 | 35.56,137.16 49.53,137.16 50.8,135.89 50.8,135.13 U1.16 52.08,133.35 167.64,133.35 168.91,132.08 168.91,105.41 171.45,102.87 171.45,82.55 170.18,81.28 PINGUINOBASE.VSS | U1.10 35.31,136.91 35.56,137.16 | U1.9 32.77,136.91 33.02,137.16 | U1.8 30.23,136.91 30.48,137.16 | U1.7 27.69,136.91 27.94,137.16 | U1.5 22.61,136.91 22.86,137.16
N$1  (1 unrouted)
N$2  (1 unrouted)
N$3  (1 unrouted)
N$5  (1 unrouted)
N$6
  Bottom 0.61: POT5.2 17.78,134.63 U1.3
N$7  (2 unrouted)
N$9  (1 unrouted)
N$10  (1 unrouted)
N$11  (1 unrouted)
N$12  (1 unrouted)
N$14  (1 unrouted)
N$15  (2 unrouted)
N$16  (2 unrouted)
N$18  (1 unrouted)
N$21  (1 unrouted)
N$22  (1 unrouted)
N$23  (2 unrouted)
N$24  (2 unrouted)
N$25  (1 unrouted)
N$27  (1 unrouted)
N$28  (1 unrouted)
N$29  (1 unrouted)
N$30  (1 unrouted)
N$31  (1 unrouted)
N$32  (1 unrouted)
N$33  (1 unrouted)
N$34  (1 unrouted)
N$35  (1 unrouted)
N$36  (1 unrouted)
N$37  (1 unrouted)
N$38  (2 unrouted)
N$39  (1 unrouted)
N$40  (1 unrouted)
N$41  (1 unrouted)
N$42  (1 unrouted)
N$45
  Bottom 0.61: U$1.4 45.72,19.05 43.18,21.59 IC4.4
N$46
  Bottom 0.61: IC4.5 45.72,21.59 48.26,19.05 U$1.3
N$47
  Bottom 0.61: IC4.6 48.26,21.59 50.8,19.05 U$1.2
N$48
  Bottom 0.61: IC4.7 50.8,21.59 53.34,19.05 U$1.1
RST  (1 unrouted)